# EAGLE schematic TamaCollar1_Mk1_Schematic_v34 (V45) (EAGLE 9.7.0)
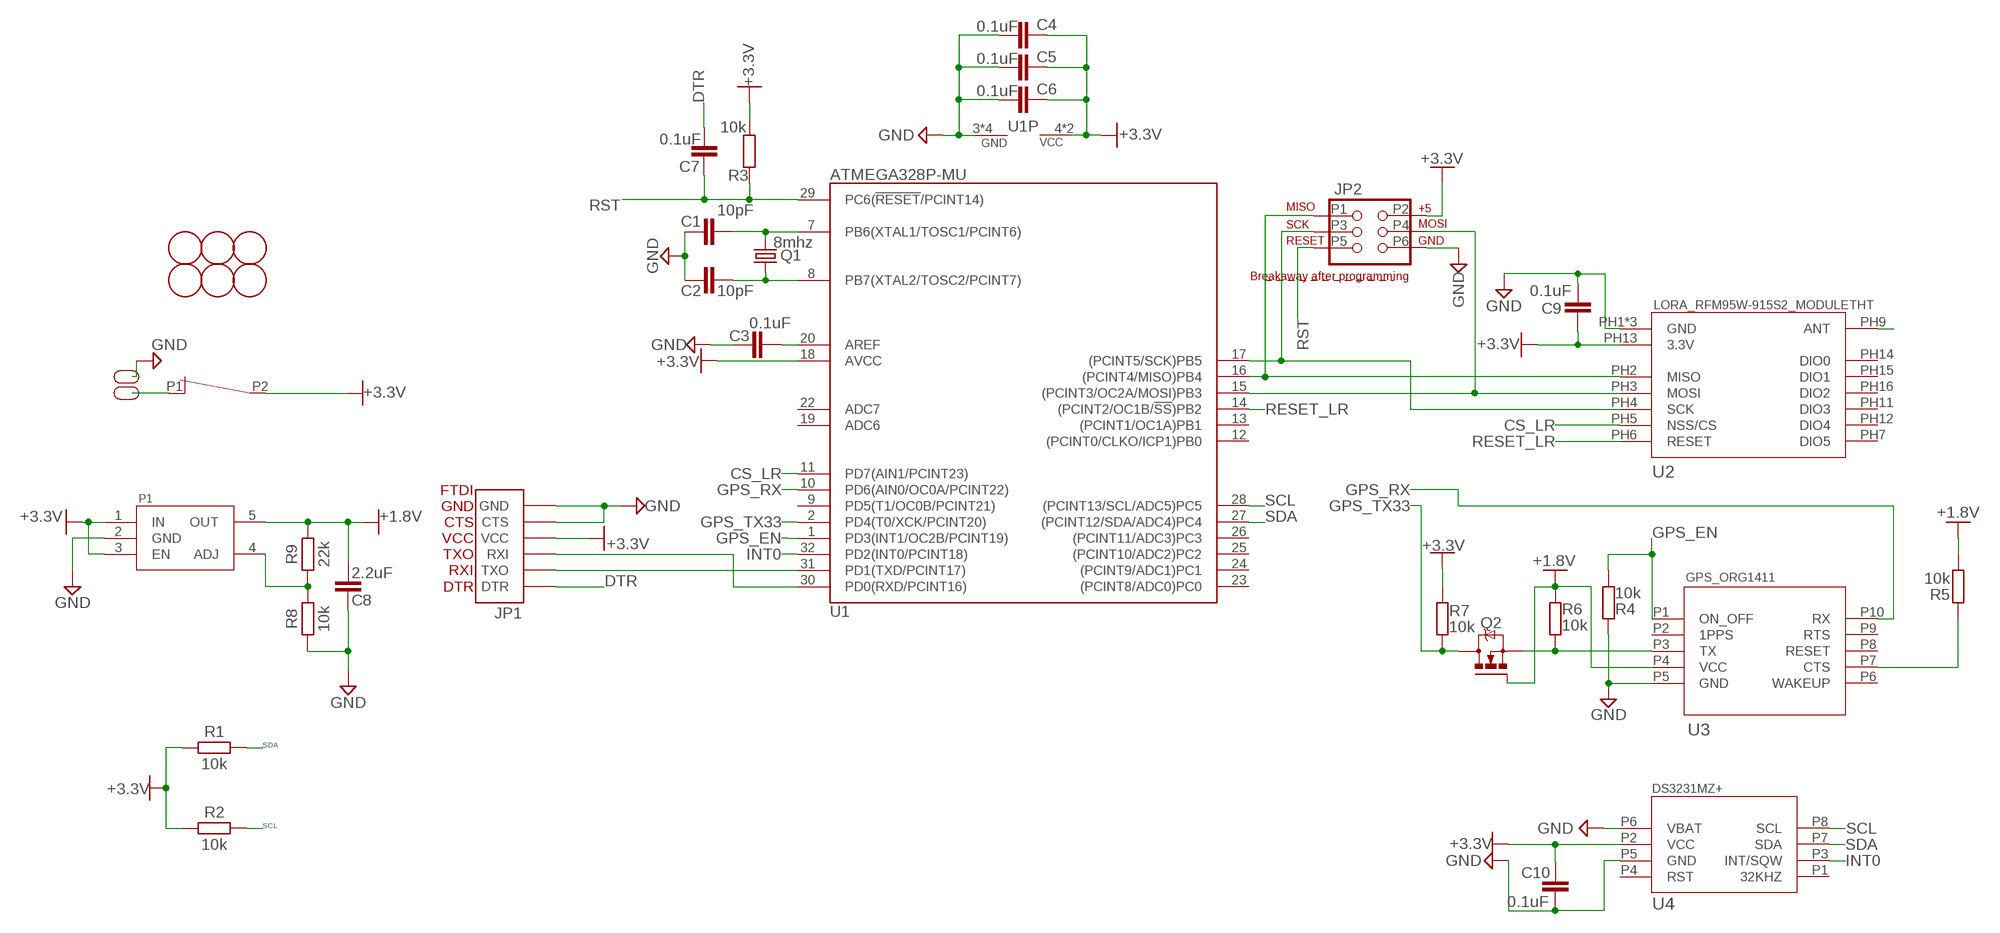
[diagram p0: schematic, sheet 1]

## Parts
BATT+  BREAKOUT_PADL  [BREAKOUT_PAD*1*1X2MM]
BR2  MOUSEBITE3X1.25  [MOUSEBITE_3H_6TRACE(1.25MM)]
C1  10pF  C_CHIP-0402(1005-METRIC)  [CAPC1005X60]
C2  10pF  C_CHIP-0402(1005-METRIC)  [CAPC1005X60]
C3  0.1uF  C_CHIP-0402(1005-METRIC)  [CAPC1005X60]
C4  0.1uF  C_CHIP-0402(1005-METRIC)  [CAPC1005X60]
C5  0.1uF  C_CHIP-0402(1005-METRIC)  [CAPC1005X60]
C6  0.1uF  C_CHIP-0402(1005-METRIC)  [CAPC1005X60]
C7  0.1uF  C_CHIP-0402(1005-METRIC)  [CAPC1005X60]
C8  2.2uF  C_CHIP-0402(1005-METRIC)  [CAPC1005X60]
C9  0.1uF  C_CHIP-0402(1005-METRIC)  [CAPC1005X60]
C10  0.1uF  C_CHIP-0402(1005-METRIC)  [CAPC1005X60]
F1  FIDUCIAL  [FIDUCIAL_1MM]
F2  FIDUCIAL  [FIDUCIAL_1MM]
F3  FIDUCIAL  [FIDUCIAL_1MM]
F4  FIDUCIAL  [FIDUCIAL_1MM]
F5  FIDUCIAL  [FIDUCIAL_1MM]
F6  FIDUCIAL  [FIDUCIAL_1MM]
GND  BREAKOUT_PADL  [BREAKOUT_PAD*1*1X2MM]
JP1  FTDI_DEVICESMALL  [FTDI_DEVICE_SMD_SMALL]
JP2  AVR_SPI_PRG_61X6  [1X6-SMD]
P1  LDO_MIC5205YM5  [MIC5205]
Q1  8mhz  CRYSTAL  [CRYSTAL_NX3225GD]
Q2  NMOSFET  NMOSFETSOT23  [SOT23]
R1  10k  R_CHIP-0402(1005-METRIC)  [RESC1005X40]
R2  10k  R_CHIP-0402(1005-METRIC)  [RESC1005X40]
R3  10k  R_CHIP-0402(1005-METRIC)  [RESC1005X40]
R4  10k  R_CHIP-0402(1005-METRIC)  [RESC1005X40]
R5  10k  R_CHIP-0402(1005-METRIC)  [RESC1005X40]
R6  10k  R_CHIP-0402(1005-METRIC)  [RESC1005X40]
R7  10k  R_CHIP-0402(1005-METRIC)  [RESC1005X40]
R8  10k  R_CHIP-0402(1005-METRIC)  [RESC1005X40]
R9  22k  R_CHIP-0402(1005-METRIC)  [RESC1005X40]
SW1  REED_SWITCH  [REED_CT05]
U1  ATMEGA328P-MU  [QFN32_5X5_0.50]
U2  LORA_RFM95W-915S2_MODULETHT  [LORA_RFM95W-915S2_16STANDOFFMODULE]
U3  GPS_ORG1411  [ORG1411]
U4  DS3231MZ+  [DS3231MZ+_SOIC8]

## Nets
+1.8V [Power]: C8.2 P1.5(OUT) Q2.1(G) R5.1 R6.2 R9.2 U3.P4(VCC)
+3.3V [Power]: C4.1 C5.1 C6.1 C9.1 C10.1 JP1.P4(VCC) JP2.P2 P1.1(IN) P1.3(EN) R1.1 R2.1 R3.1 R7.2 SW1.P2(PAD2) U1.4(VCC) U1.6(VCC) U1.18(AVCC) U2.PH13(3.3V) U4.P2(VCC)
+BATT [Power]: BATT+.P$1 SW1.P1(PAD1)
AREF: C3.2 U1.20(AREF)
CS_LR: U1.11(PD7(AIN1/PCINT23)) U2.PH5(NSS/CS)
DTR: C7.2 JP1.P1(DTR)
GND [Power]: C1.1 C2.1 C3.1 C4.2 C5.2 C6.2 C8.1 C9.2 C10.2 GND.P$1 JP1.P5(CTS) JP1.P6(GND) JP2.P6 P1.2(GND) R4.2 R8.1 U1.3(GND) U1.5(GND) U1.21(GND) U1.EXP(GND) U2.PH1(GND) U2.PH8(GND) U2.PH10(GND) U3.P5(GND) U4.P5(GND) U4.P6(VBAT)
GPS_CTS: R5.2 U3.P7(CTS)
GPS_EN: R4.1 U1.1(PD3(INT1/OC2B/PCINT19)) U3.P1(ON_OFF)
GPS_RX: U1.10(PD6(AIN0/OC0A/PCINT22)) U3.P10(RX)
GPS_TX18: Q2.2(S) R6.1 U3.P3(TX)
GPS_TX33: Q2.3(D) R7.1 U1.2(PD4(T0/XCK/PCINT20))
INT0: U1.32(PD2(INT0/PCINT18)) U4.P3(INT/SQW)
LR_ANT [RF]: U2.PH9(ANT)
MISO: JP2.P1 U1.16((PCINT4/MISO)PB4) U2.PH2(MISO)
MOSI: JP2.P4 U1.15((PCINT3/OC2A/MOSI)PB3) U2.PH3(MOSI)
P1ADJ [Power]: P1.4(ADJ) R8.2 R9.1
Q1: C1.2 Q1.P2 U1.7(PB6(XTAL1/TOSC1/PCINT6))
Q2: C2.2 Q1.P1 U1.8(PB7(XTAL2/TOSC2/PCINT7))
RESET_LR: U1.14((PCINT2/OC1B/!SS!)PB2) U2.PH6(RESET)
RST: C7.1 JP2.P5 R3.2 U1.29(PC6(!RESET!/PCINT14))
RXD: JP1.P3(RXI) U1.30(PD0(RXD/PCINT16))
SCK: JP2.P3 U1.17((PCINT5/SCK)PB5) U2.PH4(SCK)
SCL: R2.2 U1.28((PCINT13/SCL/ADC5)PC5) U4.P8(SCL)
SDA: R1.2 U1.27((PCINT12/SDA/ADC4)PC4) U4.P7(SDA)
TXD: JP1.P2(TXO) U1.31(PD1(TXD/PCINT17))
Unconnected: U1.9(PD5(T1/OC0B/PCINT21)) U1.12((PCINT0/CLKO/ICP1)PB0) U1.13((PCINT1/OC1A)PB1) U1.19(ADC6) U1.22(ADC7) U1.23((PCINT8/ADC0)PC0) U1.24((PCINT9/ADC1)PC1) U1.25((PCINT10/ADC2)PC2) U1.26((PCINT11/ADC3)PC3) U2.PH7(DIO5) U2.PH11(DIO3) U2.PH12(DIO4) U2.PH14(DIO0) U2.PH15(DIO1) U2.PH16(DIO2) U3.P2(1PPS) U3.P6(WAKEUP) U3.P8(RESET) U3.P9(RTS) U4.P1(32KHZ) U4.P4(RST)

## Notes on the sheet
- FTDI
  GND
  CTS
  VCC
  TXO
  RXI
  DTR

## Library data of the parts
BATT+ GND = CDC Library:BREAKOUT_PAD
BR2 = CDC Library:MOUSEBITE
C1 C2 = Capacitor:C: Capacitor - Generic; CATEGORY: Capacitor; LINK: https://www.evelta.com/10-pf-50v-0402-smd-multilayer-ceramic-capacitors-cc0402jrnpo9bn100-yageo/
C3-C7 C9 C10 = Capacitor:C: Capacitor - Generic; CATEGORY: Capacitor; LINK: https://www.evelta.com/100-nf-25v-0402-smd-multi-layer-ceramic-capacitor-0402x104k250ct-walsin/
C8 = Capacitor:C: Capacitor - Generic; CATEGORY: Capacitor; LINK: https://www.comkey.in/passive-components/capacitors/0402x225m6r3ct
F1-F6 = CDC Library:FIDUCIAL: For use by pick and place machines to calibrate the vision/machine, 1mm By microbuilder.eu
JP1 = CDC Library:FTDI_DEVICE: Connector which mates to FTDI basic or FTDI cable.
JP2 = CDC Library:AVR_SPI_PRG_6: AVR ISP 6 Pin This is the reduced ISP connector for AVR programming. Common on Arduino. This footprint will take up less PCB space and can be used with a 10-pin to 6-pin adapter such as SKU: BOB-08508 **Special note about "TEST_POINT" package. The stop mask is on the top side, so if you want your programming test points to be on the bottom of your board, make sure to place this package on the bottom side of the board. This also ensure that the orientation to program from the bottom side will be correct.
P1 = CDC Library:LDO_MIC5205YM5
Q1 = CDC Library:CRYSTAL: CRYSTAL; LINK: https://www.evelta.com/nx3225gd-8mhz-std-cra-3-8mhz-50ppm-crystal-8pf-surface-mount-2-smd-for-automotive/
Q2 = Transistor:NMOSFET: N-Channel MOSFET - Generic; CATEGORY: Transistor; LINK: https://www.evelta.com/bss138lt1g-50v-220ma-n-channel-transistor-surface-mount-sot-23-3/; SUB-CATEGORY: MOSFET; TYPE: N-Channel
R1 R2 = Resistor:R: Resistor Fixed - Generic; CATEGORY: Resistor; LINK: https://www.sunrom.com/p/4k7-1-0805-pack-of-100; SUB-CATEGORY: Fixed
R3 = Resistor:R: Resistor Fixed - Generic; CATEGORY: Resistor; LINK: https://www.sunrom.com/p/10k-1-0603-pack-of-100; SUB-CATEGORY: Fixed
R4-R8 = Resistor:R: Resistor Fixed - Generic; CATEGORY: Resistor; LINK: https://www.evelta.com/10k-1-0402-smd-thick-film-chip-resistor-royal-ohm-0402wgf1002tce/; SUB-CATEGORY: Fixed
R9 = Resistor:R: Resistor Fixed - Generic; CATEGORY: Resistor; LINK: https://www.evelta.com/22k-1-0402-smd-thick-film-chip-resistor-royal-ohm-0402wgf2202tce/; SUB-CATEGORY: Fixed
SW1 = CDC Library:REED_SWITCH
U1 = CDC Library:ATMEGA*8: 8-bit AVR Microcontroller 4/8/16/32 kbytes flash 512/1k/1k/2k bytes SRAM 256/512/512/1k bytes EEPROM USART, 6/8-channel 10 bit ADC Pin compatible with Atmega8(L,A) Note: ADC6 and ADC7 are not available in 28-lead packages; LINK: https://www.rhydolabz.com/components-microcontrollers-c-172_192/atmega328pmu-smd-p-2612.html
U2 = CDC Library:LORA_RFM95W-915S2_MODULE; LINK: https://www.digikey.in/product-detail/en/rf-solutions/RFM95W-915S2/RFM95W-915S2-ND/6564923
U3 = CDC Library:GPS_ORG1411
U4 = CDC Library:DS3231MZ+; LINK: https://www.evelta.com/ds3231mz-maxim-integrated-alarm-rtc-i2c-2-3-v-to-5-5-v/